# EAGLE design Joystick Module A (EAGLE 8.5.1)
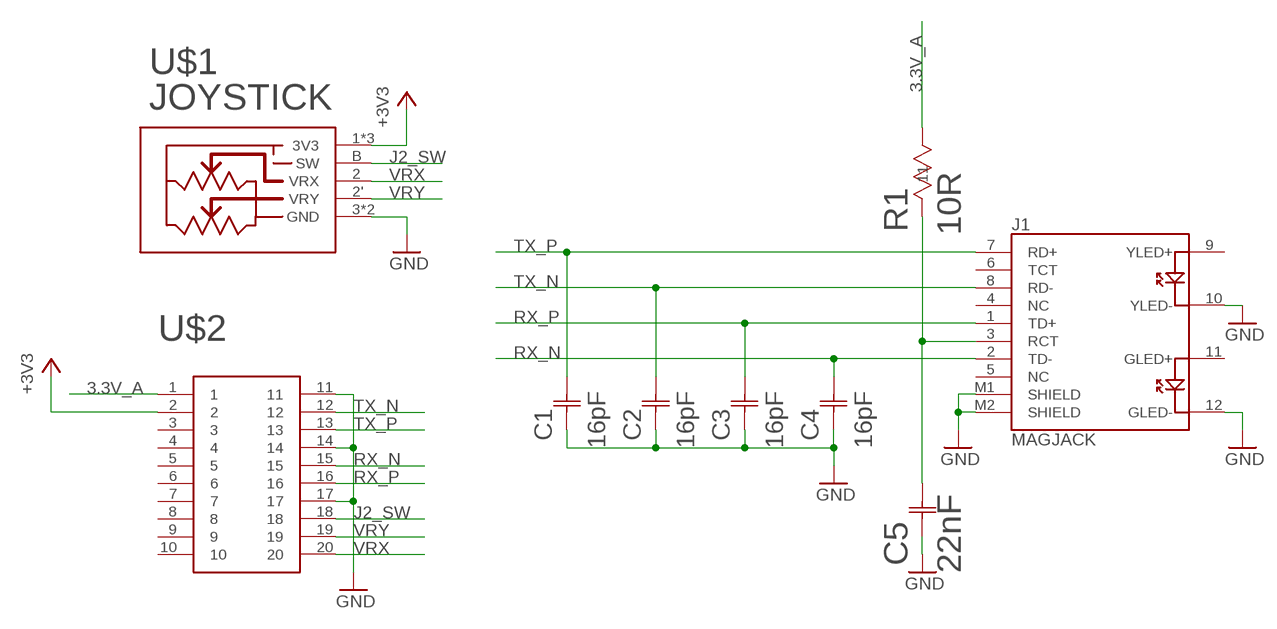
[diagram p0: schematic, sheet 1]

## Parts
C1  16pF  GRM1555C1H160JA01DG-155-M  [G-155-M]
C2  16pF  GRM1555C1H160JA01DG-155-M  [G-155-M]
C3  16pF  GRM1555C1H160JA01DG-155-M  [G-155-M]
C4  16pF  GRM1555C1H160JA01DG-155-M  [G-155-M]
C5  22nF  GRM155R71H223KA12DG-155-M  [G-155-M]
J1  MAGJACK  [MAGJACK]
R1  10R  RNCP0805FTD10R0STA_RNCP0805-M  [STA_RNCP0805-M]
U$1  JOYSTICK"  [JOYSTICK]
U$2  EDGE_CONNECTOR_20POS_CONTACTS  [EDGE_CONNECTOR_20POS_CONTACTS]

## Nets
3.3V_A: R1.2 U$2.1
+3V3: U$1.1'(3V3) U$1.1(3V3) U$1.A(3V3) U$2.2
GND: C1.1 C2.1 C3.1 C4.1 C5.1 J1.10(YLED-) J1.12(GLED-) J1.M1(SHIELD) J1.M2(SHIELD) U$1.3'(GND) U$1.3(GND) U$2.11 U$2.14 U$2.17
J2_SW: U$1.B(SW) U$2.18
N$1: C5.2 J1.3(RCT) R1.1
RX_N: C4.2 J1.2(TD-) U$2.15
RX_P: C3.2 J1.1(TD+) U$2.16
TX_N: C2.2 J1.8(RD-) U$2.12
TX_P: C1.2 J1.7(RD+) U$2.13
VRX: U$1.2(VRX) U$2.20
VRY: U$1.2'(VRY) U$2.19
Unconnected: J1.4(NC) J1.5(NC) J1.6(TCT) J1.9(YLED+) J1.11(GLED+) U$2.3 U$2.4 U$2.5 U$2.6 U$2.7 U$2.8 U$2.9 U$2.10

## Library data of the parts
C1-C4 = 16pF-capacitor:GRM1555C1H160JA01D; MANUFACTURER_PART_NUMBER: GRM1555C1H160JA01D; VENDOR: Murata
C5 = 22nF-capacitor:GRM155R71H223KA12D; MANUFACTURER_PART_NUMBER: GRM155R71H223KA12D; VENDOR: Murata
J1 = SparkFun-Connectors:MAGJACK: MAGJACK: RJ-45 with LEDs This is a single port, RJ45 ethernet jacks with built in transformer (magnetics), status LEDs, and shielding. Here is the connector we sell at SparkFun: RJ45 Ethernet MagJack-Compatible <https://www.sparkfun.com/products/8534> (PRT-08534) Datasheet <http://www.sparkfun.com/datasheets/Prototyping/MagJack.pdf> It is used on this SparkFun product: SparkFun RJ45 MagJack Breakout <https://www.sparkfun.com/products/13021> (BOB-13021); PROD_ID: CONN-09556; SF_ID: PRT-08534
R1 = 10-resistor:RNCP0805FTD10R0; COPYRIGHT: Copyright C 2015 Accelerated Designs. All rights reserved; MANUFACTURER_PART_NUMBER: RNCP0805FTD10R0; VENDOR: Vendor
U$1 = thanics_robotics:JOYSTICK
U$2 = thanics_robotics:EDGE_CONNECTOR_20POS_CONTACTS

## Board
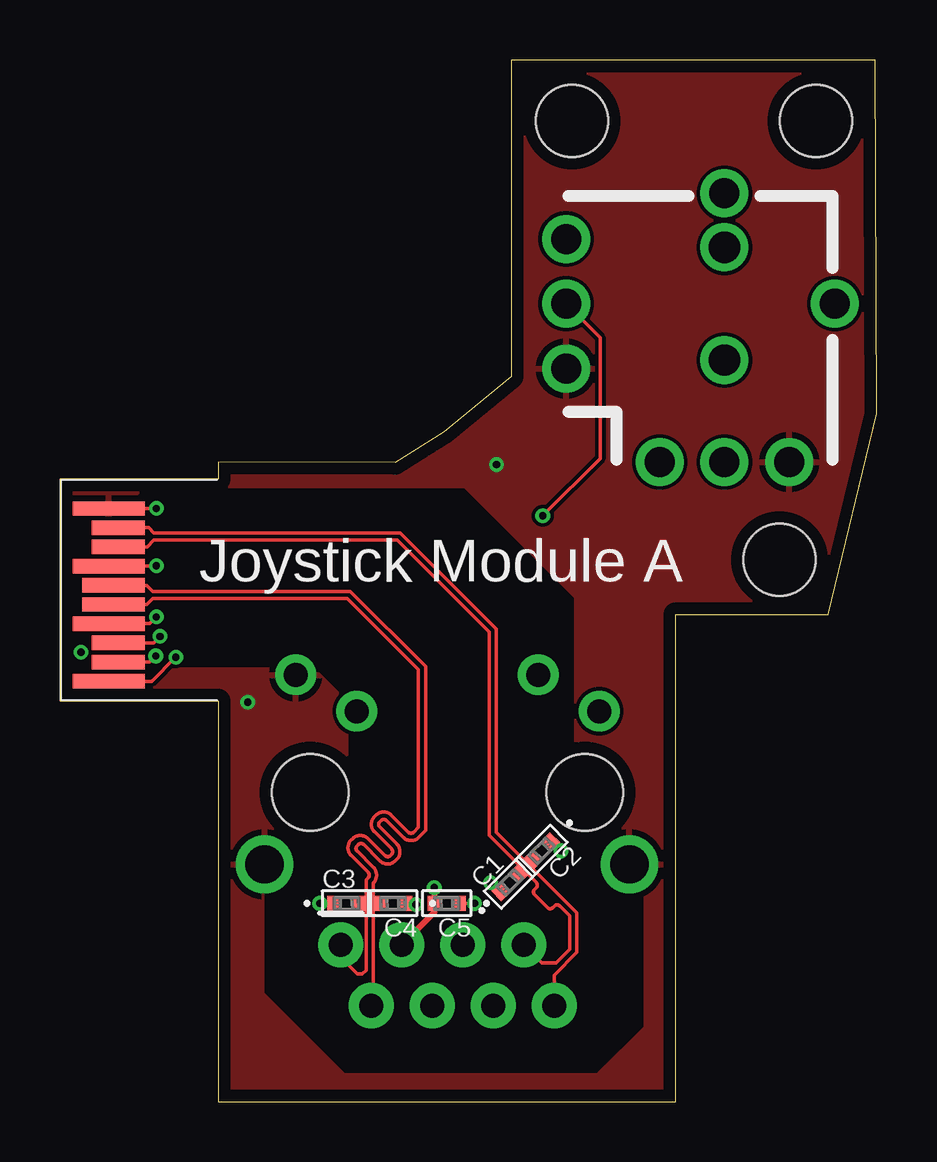
[diagram p1: board, top side]
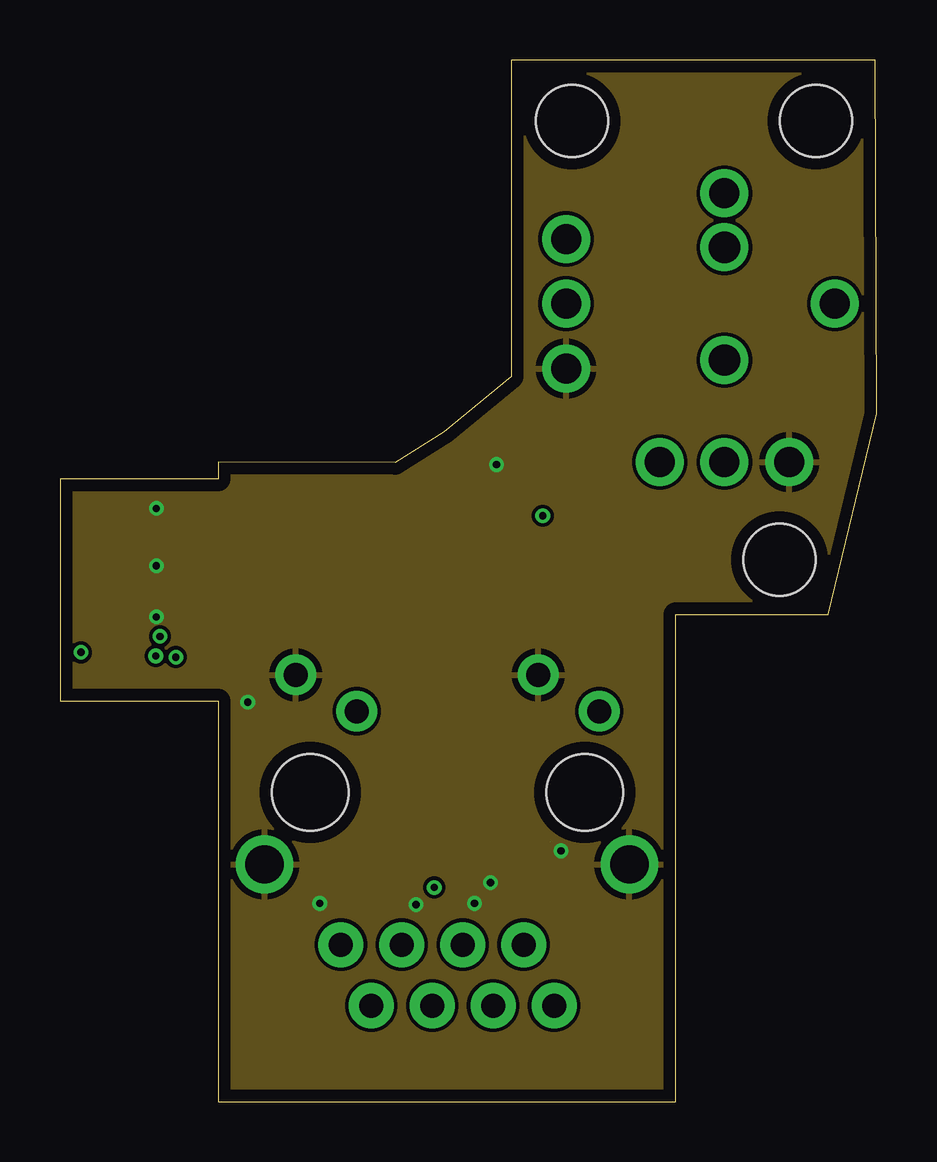
[diagram p2: board, inner layer Route2]
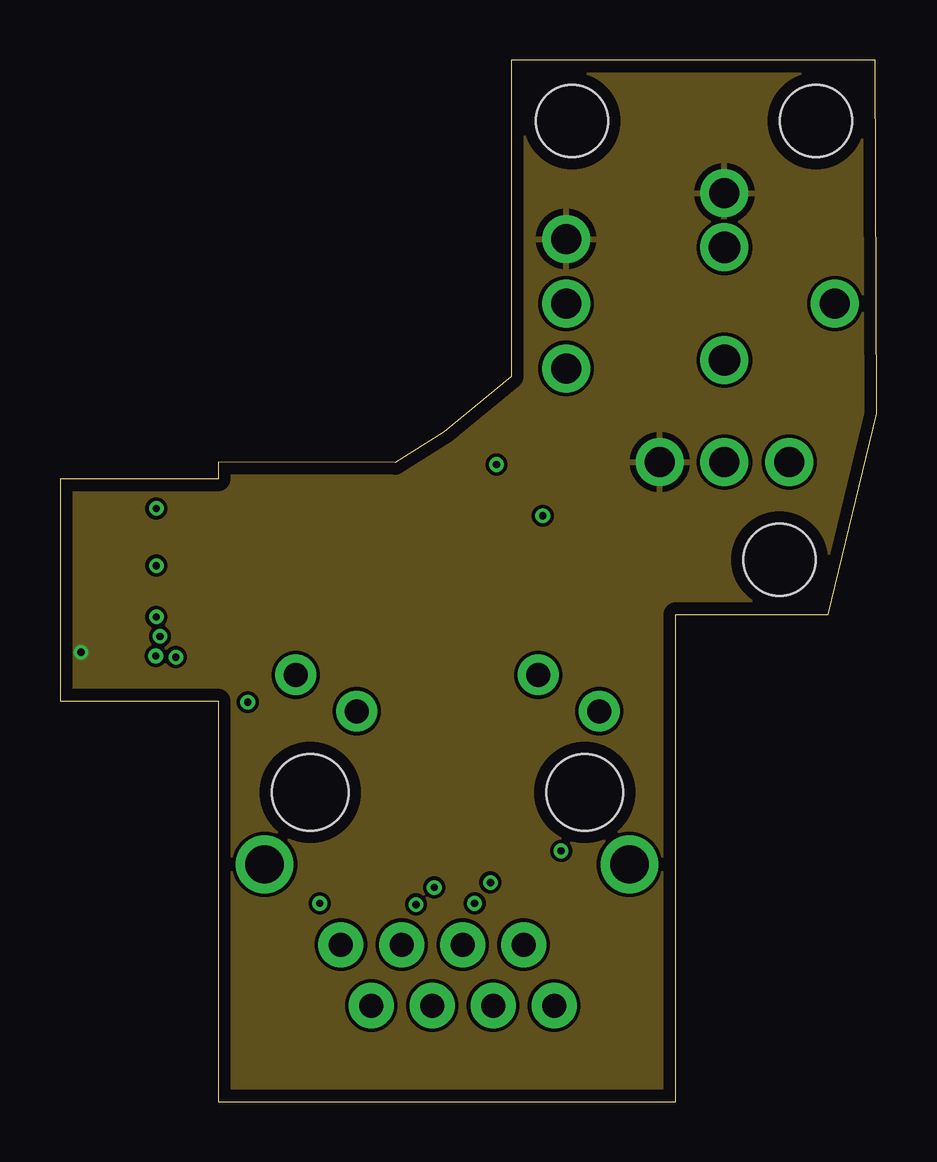
[diagram p3: board, inner layer Route15]
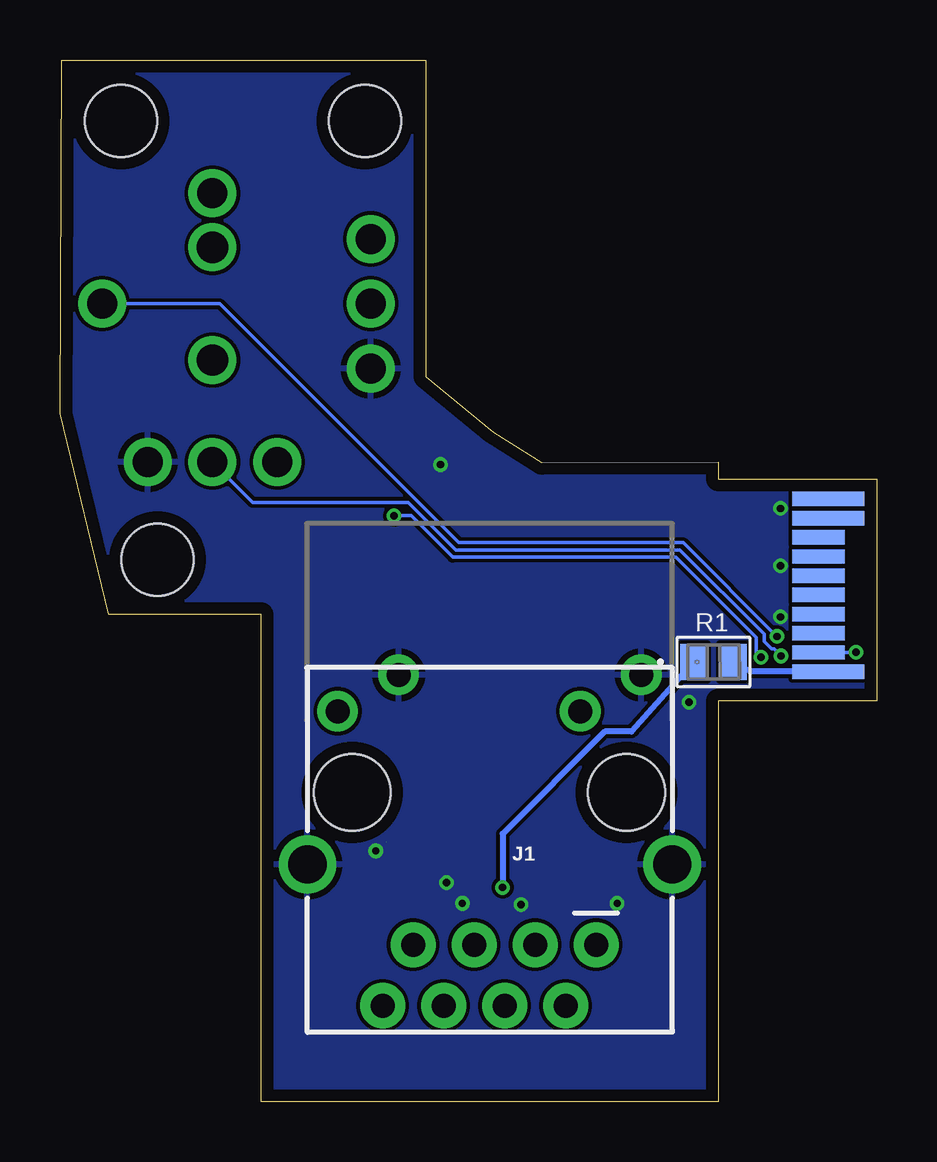
[diagram p4: board, bottom side, seen from below]

Size 34.04 x 43.43 mm. Coordinates in mm from the lower left corner, seen from the top.
Outline: 6.6,0 25.65,0 25.65,20.32 32,20.32 34.04,28.7 33.96,43.42 18.8,43.43 18.8,30.23 15.99,27.93 13.97,26.66 6.6,26.67 6.6,25.96 0,25.96 0,16.71 6.6,16.71 6.6,0
Copper layers (1*2*15*16): Top 0.035mm / dielectric 0.2mm / Route2 0.0175mm / dielectric 1.2mm / Route15 0.0175mm / dielectric 0.2mm / Bottom 0.035mm
Design rules "Elecrow_4-layer_PCB_eagle_rule *": minimum track width 6mil, minimum drill 12mil, track to track 6mil, track to pad 6mil, pad to pad 6mil, via to via 8mil, smd to smd 0mil, copper to edge 20mil, drill to drill 10mil, minimum pad ring 6mil, minimum via ring 6mil, stop-mask expansion 0mil, vias tented up to drill 100mil, thermal gap 10mil
Holes 3 mm at 29.97,22.61 21.34,40.89 31.5,40.89

### Footprints (pad centres in the part's own frame; a part is rotated, then mirrored left to right if it is on the bottom)
G-155-M = smd 0.559 x 0.61: 1 -0.521,0; 2 0.521,0
MAGJACK = drill 1 pad 1.88: 1 -4.445,6.015; 2 -3.175,8.555; 3 -1.905,6.015; 4 -0.635,8.555; 5 0.635,6.015; 6 1.905,8.555; 7 3.175,6.015; 8 4.445,8.555 | drill 1 pad 1.7: 9 -3.785,-3.715; 10 -6.325,-5.235; 11 6.325,-3.715; 12 3.785,-5.235 | drill 1.6 pad 2.184: M1 -7.62,2.67; M2 7.58,2.67 | hole 3.2: -5.715,-0.335; 5.715,-0.335
STA_RNCP0805-M = smd 1.118 x 1.499: 1 -0.826,0; 2 0.826,0
JOYSTICK = drill 1.25 pad 2: 1 -6.6,2.7; 1' -2.7,-6.6; 2 -6.6,0; 2' 0,-6.6; 3 -6.6,-2.7; 3' 2.7,-6.6; A 0,4.6; B 4.6,0 | drill 1.3 pad 2: P$9 0,2.35; P$10 0,-2.35
EDGE_CONNECTOR_20POS_CONTACTS = smd 0.6 x 3 bottom: 1 -3.4,0; 9 3,0; 10 3.8,0 | smd 0.6 x 2.2 bottom: 2 -2.6,-0.4; 3 -1.8,-0.4; 4 -1,-0.4; 5 -0.2,-0.4; 6 0.6,-0.4; 7 1.4,-0.4; 8 2.2,-0.4 | smd 0.6 x 3: 11 3.4,0; 14 1,0; 17 -1.4,0; 20 -3.8,0 | smd 0.6 x 2.2: 12 2.6,-0.4; 13 1.8,-0.4; 18 -2.2,-0.4; 19 -3,-0.4 | smd 0.6 x 2.6: 15 0.2,-0.2; 16 -0.6,-0.2

### Placement (x,y rotation side)
C1  18.75,9.14 45 top
C2  20.07,10.46 225 top
C3  11.94,8.28 0 top
C4  13.87,8.28 180 top
C5  16.12,8.28 180 top
J1  16.14,12.57 180 bottom
R1  6.81,18.34 0 bottom
U$1  27.69,33.27 0 top
U$2  2.03,21.34 90 top

### Tracks (layer width: path | path; a pad name or v marks a point on that pad's centre or on a via)
3.3V_A
  Bottom 0.254: U$2.1 5.27,17.94 R1.2
+3V3  (via drill 0.3)
  Bottom 0.152: U$2.2 0.88,18.74 v0.88,18.75
  pour Route15: -1.12,43.94 34.54,43.94 34.54,-1.02 -1.12,-1.02
GND  (via drill 0.3)  (1 unrouted)
  Top 0.152: C3.1 v10.82,8.28 | C5.1 v17.27,8.28 | v14.83,8.23 14.44,8.23 C4.1 | v17.93,9.14 18.3,8.78 C1.1 | v20.88,10.46 20.51,10.83 C2.1 | v4.01,22.35 4,22.34 U$2.14 | v4.01,24.74 U$2.11 | v4.01,20.22 3.73,19.94 U$2.17
  other vias: 7.82,16.66 18.19,26.57
  pour Top (rank 2): 0.05,48.41 35.05,48.26 35.05,-1.27 0.05,-1.12
  pour Bottom: 0,48.72 37.03,48.11 37.03,-1.42 0,-0.81
  pour Route2: -0.76,43.94 34.49,43.94 34.49,-0.41 -0.76,-0.41
J2_SW  (via drill 0.3)
  Top 0.152: U$2.18 3.9,19.14 v4.17,19.41
  Bottom 0.152: v4.17,19.41 8.08,23.32 17.42,23.32 27.38,33.27 U$1.B
N$1  (via drill 0.3)
  Top 0.254: v15.6,8.94 C5.2 15.6,7.91 J1.3
  Bottom 0.254: R1.1 10.22,15.44 11.33,15.44 15.6,11.18 v15.6,8.94
N$2
  cutout Top: 3.56,25.5 16.81,25.5 19.15,23.16 21.34,20.98 21.34,12.09 24.23,9.19 24.23,5.23 24.23,3.15 22.35,1.27 11.89,1.27 8.59,4.57 8.59,10.92 12.09,14.43 12.09,16.71 10.62,18.19 2.9,18.19 1.68,19.41 1.68,23.62
RX_N
  Top 0.152: U$2.15 3.61,21.54 3.86,21.29 12.1,21.29 15.24,18.15 15.24,11.32 14.95,11.03 arc-90 14.3,11.03 13.6,11.73 arc90 13.38,11.73 13.32,11.68 arc90 13.32,11.46 14.03,10.75 arc-90 14.03,10.11 13.97,10.05 arc-90 13.33,10.05 12.65,10.73 arc90 12.43,10.73 12.38,10.67 arc90 12.38,10.46 13.06,9.78 arc-90 13.06,9.13 13.06,8.33 | 13.06,8.33 13.06,4.1 J1.2 | C4.2 13.11,8.28 13.06,8.33
RX_P
  Top 0.152: U$2.16 3.62,20.74 3.86,20.98 11.98,20.98 14.94,18.02 14.94,11.44 14.73,11.24 arc-90 14.52,11.24 13.81,11.95 arc90 13.16,11.95 13.11,11.89 arc90 13.11,11.25 13.82,10.54 arc-90 13.82,10.32 13.76,10.27 arc-90 13.54,10.27 12.84,10.97 arc90 12.19,10.97 12.13,10.92 arc90 12.13,10.27 12.84,9.56 arc-90 12.84,9.35 12.75,9.26 12.75,8.28 | 12.75,8.28 12.75,5.49 12.6,5.33 12.39,5.33 11.7,6.03 J1.1 | C3.2 12.75,8.28
TX_N
  Top 0.152: U$2.12 3.7,23.94 3.91,23.72 14.19,23.72 18.19,19.72 18.19,11.24 19.51,9.91 | J1.8 20.59,5.29 21.54,6.24 21.54,7.89 19.51,9.91 | C2.2 | 19.51,9.91 C2.2
TX_P
  Top 0.152: U$2.13 3.63,23.14 3.91,23.42 14.06,23.42 17.88,19.6 17.88,11.11 19.3,9.7 | 19.3,9.7 19.85,9.15 arc-90 19.85,8.93 19.77,8.86 arc90 19.77,8.64 20.32,8.1 arc90 20.53,8.1 20.61,8.17 arc-90 20.82,8.17 21.23,7.76 21.23,6.36 20.67,5.8 20.08,5.8 J1.7 | C1.2 19.3,9.7
VRX  (via drill 0.3)
  Top 0.152: U$2.20 3.82,17.54 v4.83,18.54 | v20.12,24.44 22.5,26.82 22.5,31.86 U$1.2
  Bottom 0.152: v4.83,18.54 5.03,18.75 5.03,19.36 8.38,22.71 17.68,22.71 19.4,24.44 v20.12,24.44
VRY  (via drill 0.3)
  Top 0.152: U$2.19 3.73,18.34 v3.99,18.59
  Bottom 0.152: v3.99,18.59 4.27,18.87 4.39,18.87 4.7,19.19 4.7,19.51 8.2,23.01 17.55,23.01 19.53,24.99 26.01,24.99 U$1.2'

### Text on the board
tPlace: Joystick Module A